# Altium schematic sheet Sheet2_W5500.SchDoc
size 420 x 297 mm; SheetNumber: 2; SheetTotal: 2; 2oboznachenieDocumenta: АСТА.468353.020 Э3; 1.2naimenovanieDocumenta: Схема электрическая принципиальная; 7poryadkoviiNomerLista: 2; 8obscheeKolichestvoListov: 2; 13.1dataPodpisiRazrabotchika: 22.02.23
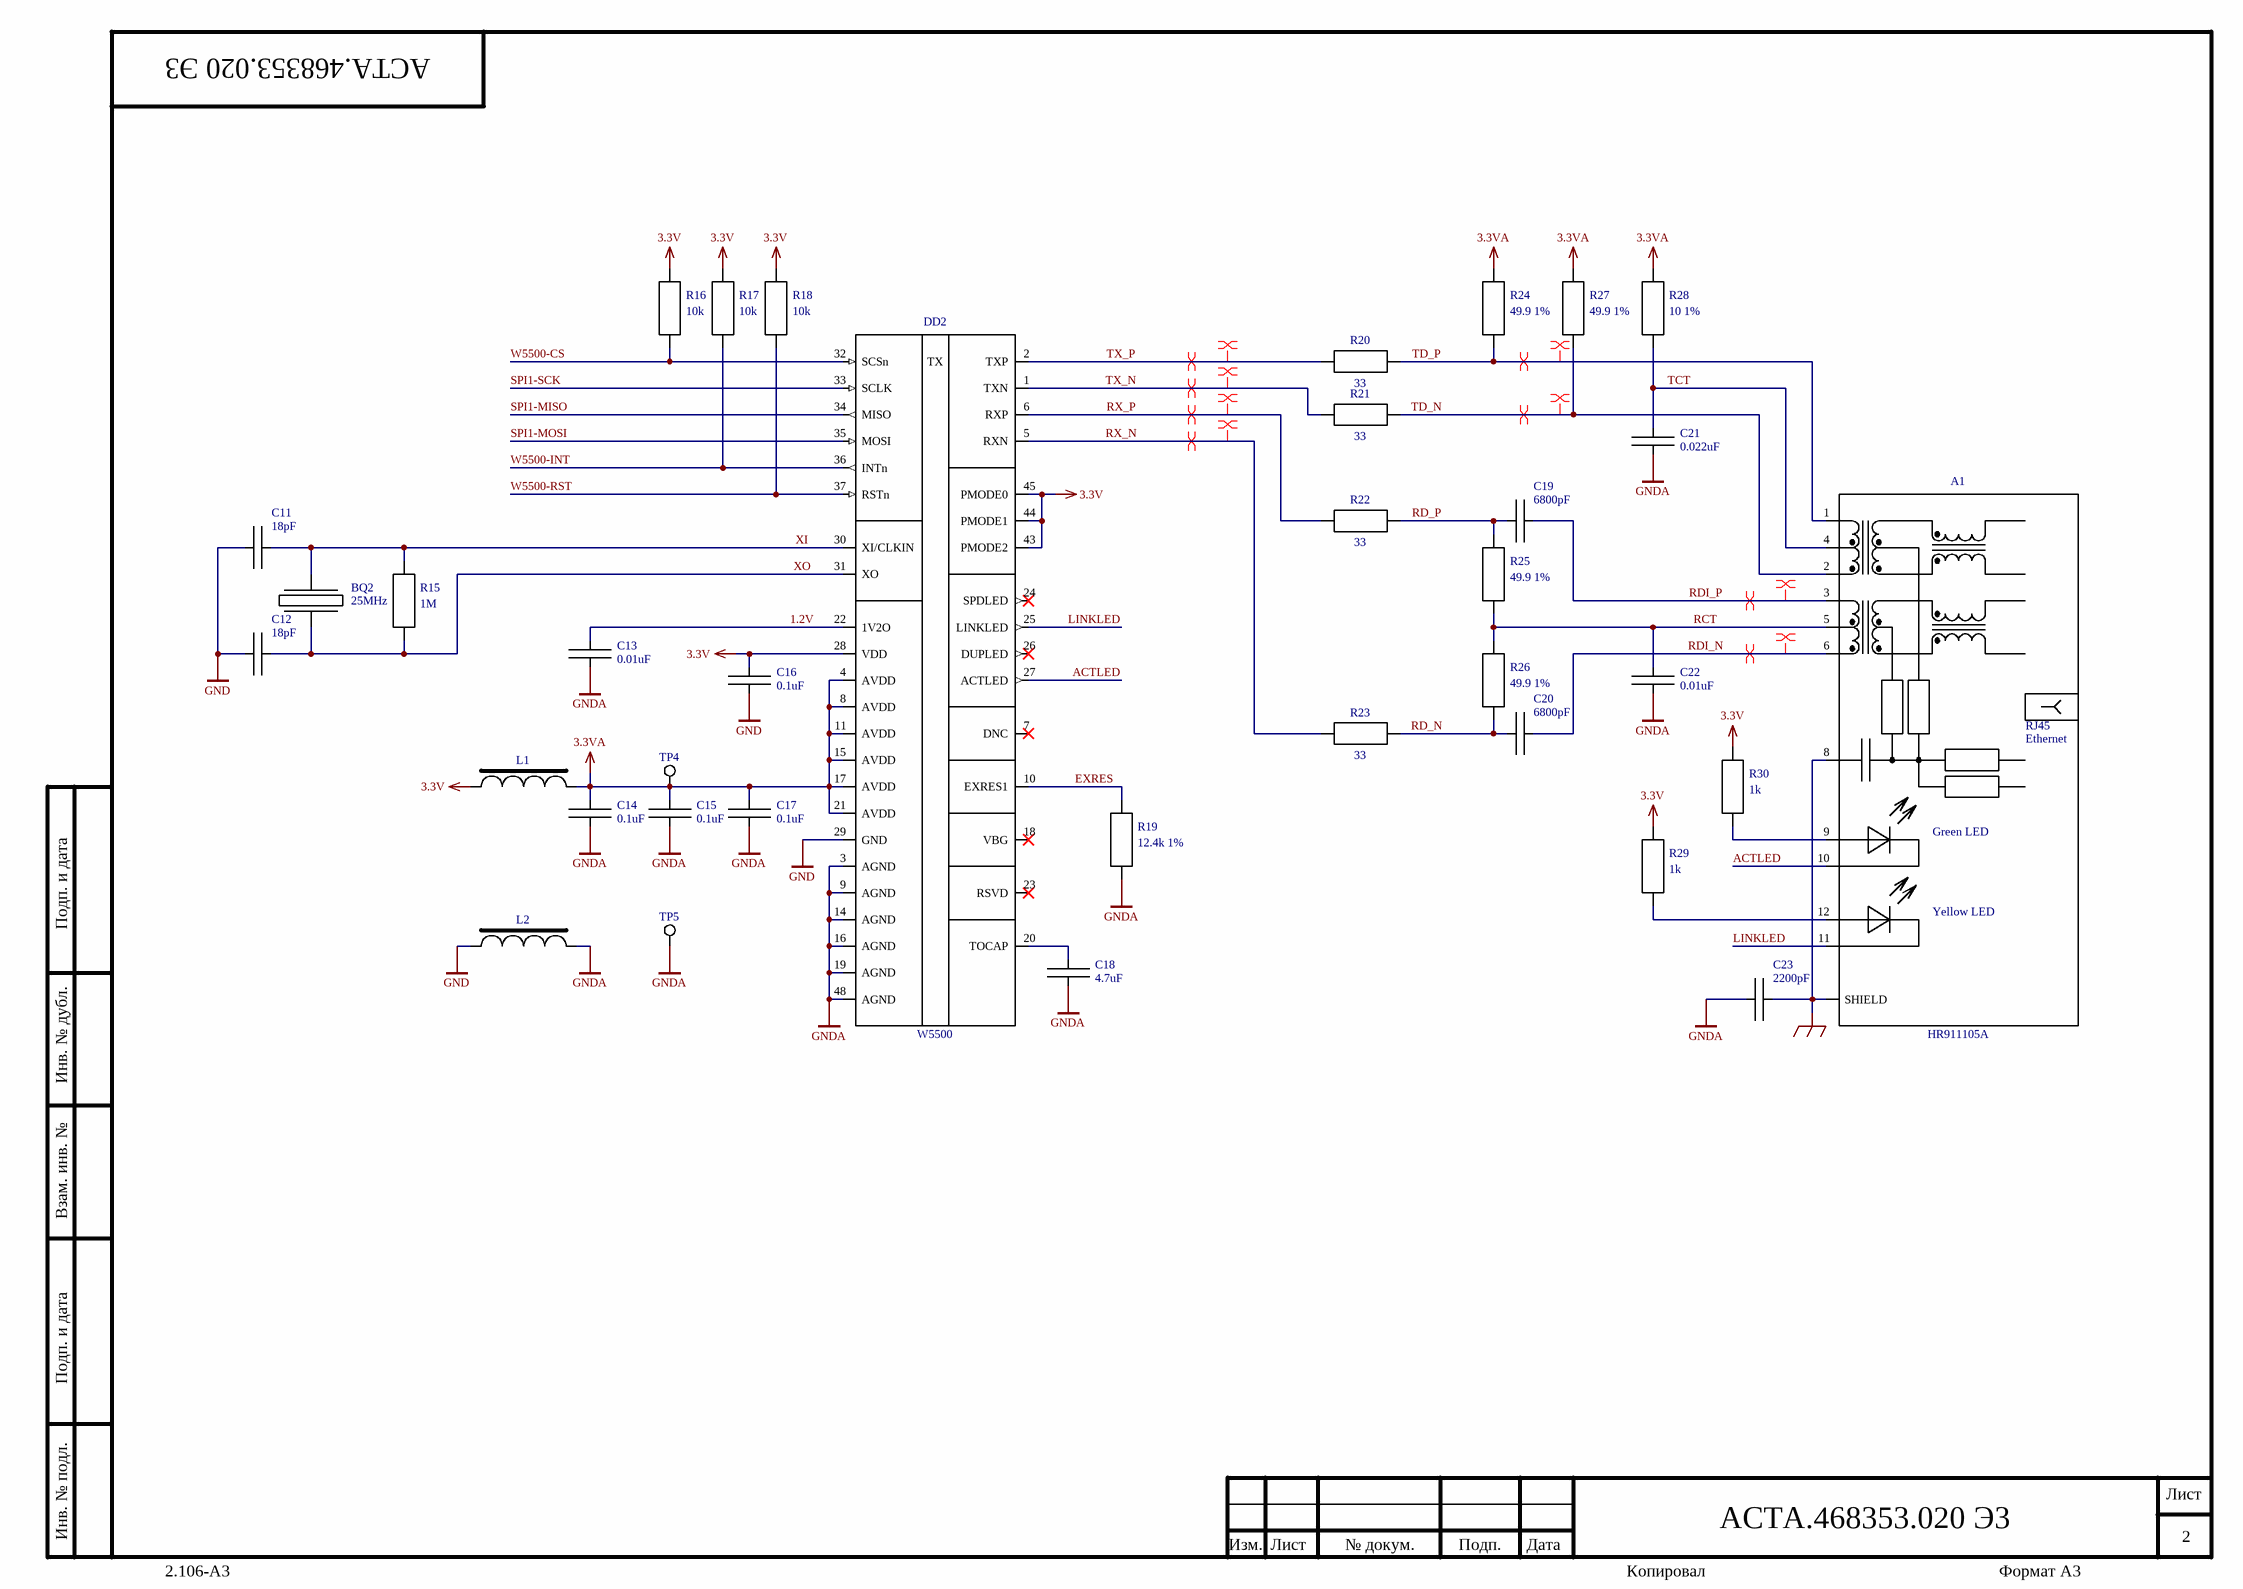
[diagram p0: Sheet2_W5500.SchDoc]

## Parts
A1  HR911105A  [HR911105A]
BQ2  value 25MHz  [HT-49S]  (hidden comment: HT-49S_Rated)
C11  value 18pF  [CAP0805]  (hidden comment: CAP0805_Rated)
C12  value 18pF  [CAP0805]  (hidden comment: CAP0805_Rated)
C13  value 0.01uF  [CAP0805]  (hidden comment: CAP0805_Rated)
C14  value 0.1uF  [CAP0805]  (hidden comment: CAP0805_Rated)
C15  value 0.1uF  [CAP0805]  (hidden comment: CAP0805_Rated)
C16  value 0.1uF  [CAP0805]  (hidden comment: CAP0805_Rated)
C17  value 0.1uF  [CAP0805]  (hidden comment: CAP0805_Rated)
C18  value 4.7uF  [CAP1206]  (hidden comment: CAP1206_Rated)
C19  value 6800pF  [CAP0805]  (hidden comment: CAP0805_Rated)
C20  value 6800pF  [CAP0805]  (hidden comment: CAP0805_Rated)
C21  value 0.022uF  [CAP0805]  (hidden comment: CAP0805_Rated)
C22  value 0.01uF  [CAP0805]  (hidden comment: CAP0805_Rated)
C23  value 2200pF  [CAP1812]  (hidden comment: CAP1812_Rated)
DD2  W5500  [LQFP-48]
L1  BLM21BD121SN1D  [IND0805]  (value not drawn)
L2  BLM21BD121SN1D  [IND0805]  (value not drawn)
R15  value 1M  [RES0805]  (hidden comment: RES0805_Rated)
R16  value 10k  [RES0805]  (hidden comment: RES0805_Rated)
R17  value 10k  [RES0805]  (hidden comment: RES0805_Rated)
R18  value 10k  [RES0805]  (hidden comment: RES0805_Rated)
R19  value 12.4k 1%  [RES0805]  (hidden comment: RES0805_Rated)
R20  value 33  [RES0805]  (hidden comment: RES0805_Rated)
R21  value 33  [RES0805]  (hidden comment: RES0805_Rated)
R22  value 33  [RES0805]  (hidden comment: RES0805_Rated)
R23  value 33  [RES0805]  (hidden comment: RES0805_Rated)
R24  value 49.9 1%  [RES0805]  (hidden comment: RES0805_Rated)
R25  value 49.9 1%  [RES0805]  (hidden comment: RES0805_Rated)
R26  value 49.9 1%  [RES0805]  (hidden comment: RES0805_Rated)
R27  value 49.9 1%  [RES0805]  (hidden comment: RES0805_Rated)
R28  value 10 1%  [RES0805]  (hidden comment: RES0805_Rated)
R29  value 1k  [RES0805]  (hidden comment: RES0805_Rated)
R30  value 1k  [RES0805]  (hidden comment: RES0805_Rated)
TP4  TestPad  [PAD-TH-OCT1x1-0.5]  (value not drawn)  (no BOM)
TP5  TestPad  [PAD-TH-OCT1x1-0.5]  (value not drawn)  (no BOM)

## Nets
3.3V: C16.1 DD2.28(VDD) DD2.43(PMODE2) DD2.44(PMODE1) DD2.45(PMODE0) L1.1 R16.2 R17.2 R18.2 R29.2 R30.2
3.3VA: C14.1 C15.1 C17.1 DD2.4(AVDD) DD2.8(AVDD) DD2.11(AVDD) DD2.15(AVDD) DD2.17(AVDD) DD2.21(AVDD) L1.2 R24.2 R27.2 R28.2 TP4.1
EARTH: A1.8(GND) A1.SHIELD C23.2
GND: C11.1 C12.1 C16.2 DD2.29(GND) L2.1
GNDA: C13.2 C14.2 C15.2 C17.2 C18.2 C21.2 C22.2 C23.1 DD2.3(AGND) DD2.9(AGND) DD2.14(AGND) DD2.16(AGND) DD2.19(AGND) DD2.48(AGND) L2.2 R19.1 TP5.1
1.2V: C13.1 DD2.22(1V2O)
ACTLED: A1.10(LED1-K) DD2.27(ACTLED)
EXRES: DD2.10(EXRES1) R19.2
LINKLED: A1.11(LED2-A) DD2.25(LINKLED)
RCT: A1.5(CT) C22.1 R25.1 R26.2
RD_N: C20.1 R23.2 R26.1
RD_P: C19.1 R22.2 R25.2
RDI_N: A1.6(RD-) C20.2
RDI_P: A1.3(RD+) C19.2
RX_N: DD2.5(RXN) R23.1
RX_P: DD2.6(RXP) R22.1
SPI1-MISO: DD2.34(MISO)
SPI1-MOSI: DD2.35(MOSI)
SPI1-SCK: DD2.33(SCLK)
TCT: A1.4(CT) C21.1 R28.1
TD_N: A1.2(TD-) R21.2 R27.1
TD_P: A1.1(TD+) R20.2 R24.1
TX_N: DD2.1(TXN) R21.1
TX_P: DD2.2(TXP) R20.1
W5500-CS: DD2.32(SCSn) R16.1
W5500-INT: DD2.36(INTn) R17.1
W5500-RST: DD2.37(RSTn) R18.1
XI: BQ2.1 C11.2 DD2.30(XI/CLKIN) R15.2
XO: BQ2.2 C12.2 DD2.31(XO) R15.1
NetA1_9: A1.9(LED1-A) R30.1
NetA1_12: A1.12(LED2-K) R29.1
NetC18_1: C18.1 DD2.20(TOCAP)

Not connected (* = marked no-connect by the designer): DD2 7(DNC)* 18(VBG)* 23(RSVD)* 24(SPDLED)* 26(DUPLED)*

## Layout directives
differential pair: RDI_N, RDI_P, RX_N, RX_P, TD_N, TD_P, TX_N, TX_P
net class ETHERNET: RDI_N, RDI_P, RX_N, RX_P, TD_N, TD_P, TX_N, TX_P

## Notes on the sheet
- Подп. и дата
- Инв. № дубл.
- Взам. инв. №
- Инв. № подл.
- Изм.
- Лист
- № докум.
- Подп.
- Дата
- 2.106-A3
- Копировал
- Формат А3
- (in symbol HR911105A) RJ45; Ethernet; Green LED; Yellow LED
- (in symbol W5500) TX

## Library data of the parts
A1 = HR911105A: Ethernet Connector 10/100 1x1 Tab Down RJ45 w/mag G/Y LED
DD2 = W5500: Ethernet ICs 3in1 Enet Controller TCP/IP +MAC+PHY
L1 L2 = BLM21BD121SN1D: Ferrite Bead 0805 120 Ohm; Manufacturer: Murata; Value: 120 Ohm; 1Ccode: М00053470; 1Cname: BLM21BD121SN1D MUR; 1Cgroup: 01010901; 1Carticle: 42076; Name: Фильтр BLM21BD121SN1D; Tolerance: 25%; RatedCurrent: 200mA; DCResistance: 0.25 Ohm; 1CfullName: BLM21BD121SN1D MUR; PartNumber: BLM21BD121SN1D; ComponentLink1Description: DatasheetLink; ComponentLink1URL: *; Case: 0805
R15-R30 = RES0805_Rated: Tolerance: 5%; 1Ccode: *; 1Cname: *; 1CfullName: *; 1Cgroup: *; 1Carticle: *; Name: *; Manufacturer: *; PartNumber: *; DatasheetLink: *; Case: *
TP4 TP5 = TestPad: TestPoint on PCB; Label: "Label"
BQ2 = HT-49S_Rated: 1Ccode: *; 1Cname: *; 1CfullName: *; 1Cgroup: *; 1Carticle: *; Manufacturer: *; Name: *; PartNumber: *; Case: *; Tolerance: *; ComponentLink1Description: DatasheetLink; ComponentLink1URL: *; Frequency: *
C11-C17 C19-C22 = CAP0805_Rated: 1Ccode: *; 1Cname: *; 1CfullName: *; 1Cgroup: *; 1Carticle: *; Manufacturer: *; Name: *; PartNumber: *; ComponentLink1Description: DatasheetLink; ComponentLink1URL: *; Case: 0805; Tolerance: *; RatedVoltage: *; TemperatureCharacteristic: *
C18 = CAP1206_Rated: 1Ccode: *; 1Cname: *; 1CfullName: *; 1Cgroup: *; 1Carticle: *; Manufacturer: *; Name: *; PartNumber: *; ComponentLink1Description: DatasheetLink; ComponentLink1URL: *; Case: 1206; Tolerance: *; RatedVoltage: *; TemperatureCharacteristic: *
C23 = CAP1812_Rated: 1Ccode: *; 1Cname: *; 1CfullName: *; 1Cgroup: *; 1Carticle: *; Manufacturer: *; Name: *; PartNumber: *; ComponentLink1Description: DatasheetLink; ComponentLink1URL: *; Case: 1812; Tolerance: *; RatedVoltage: *; TemperatureCharacteristic: *